# EAGLE design SuperTiny-REV2-Corrected-Stencil (EAGLE 9.6.2)
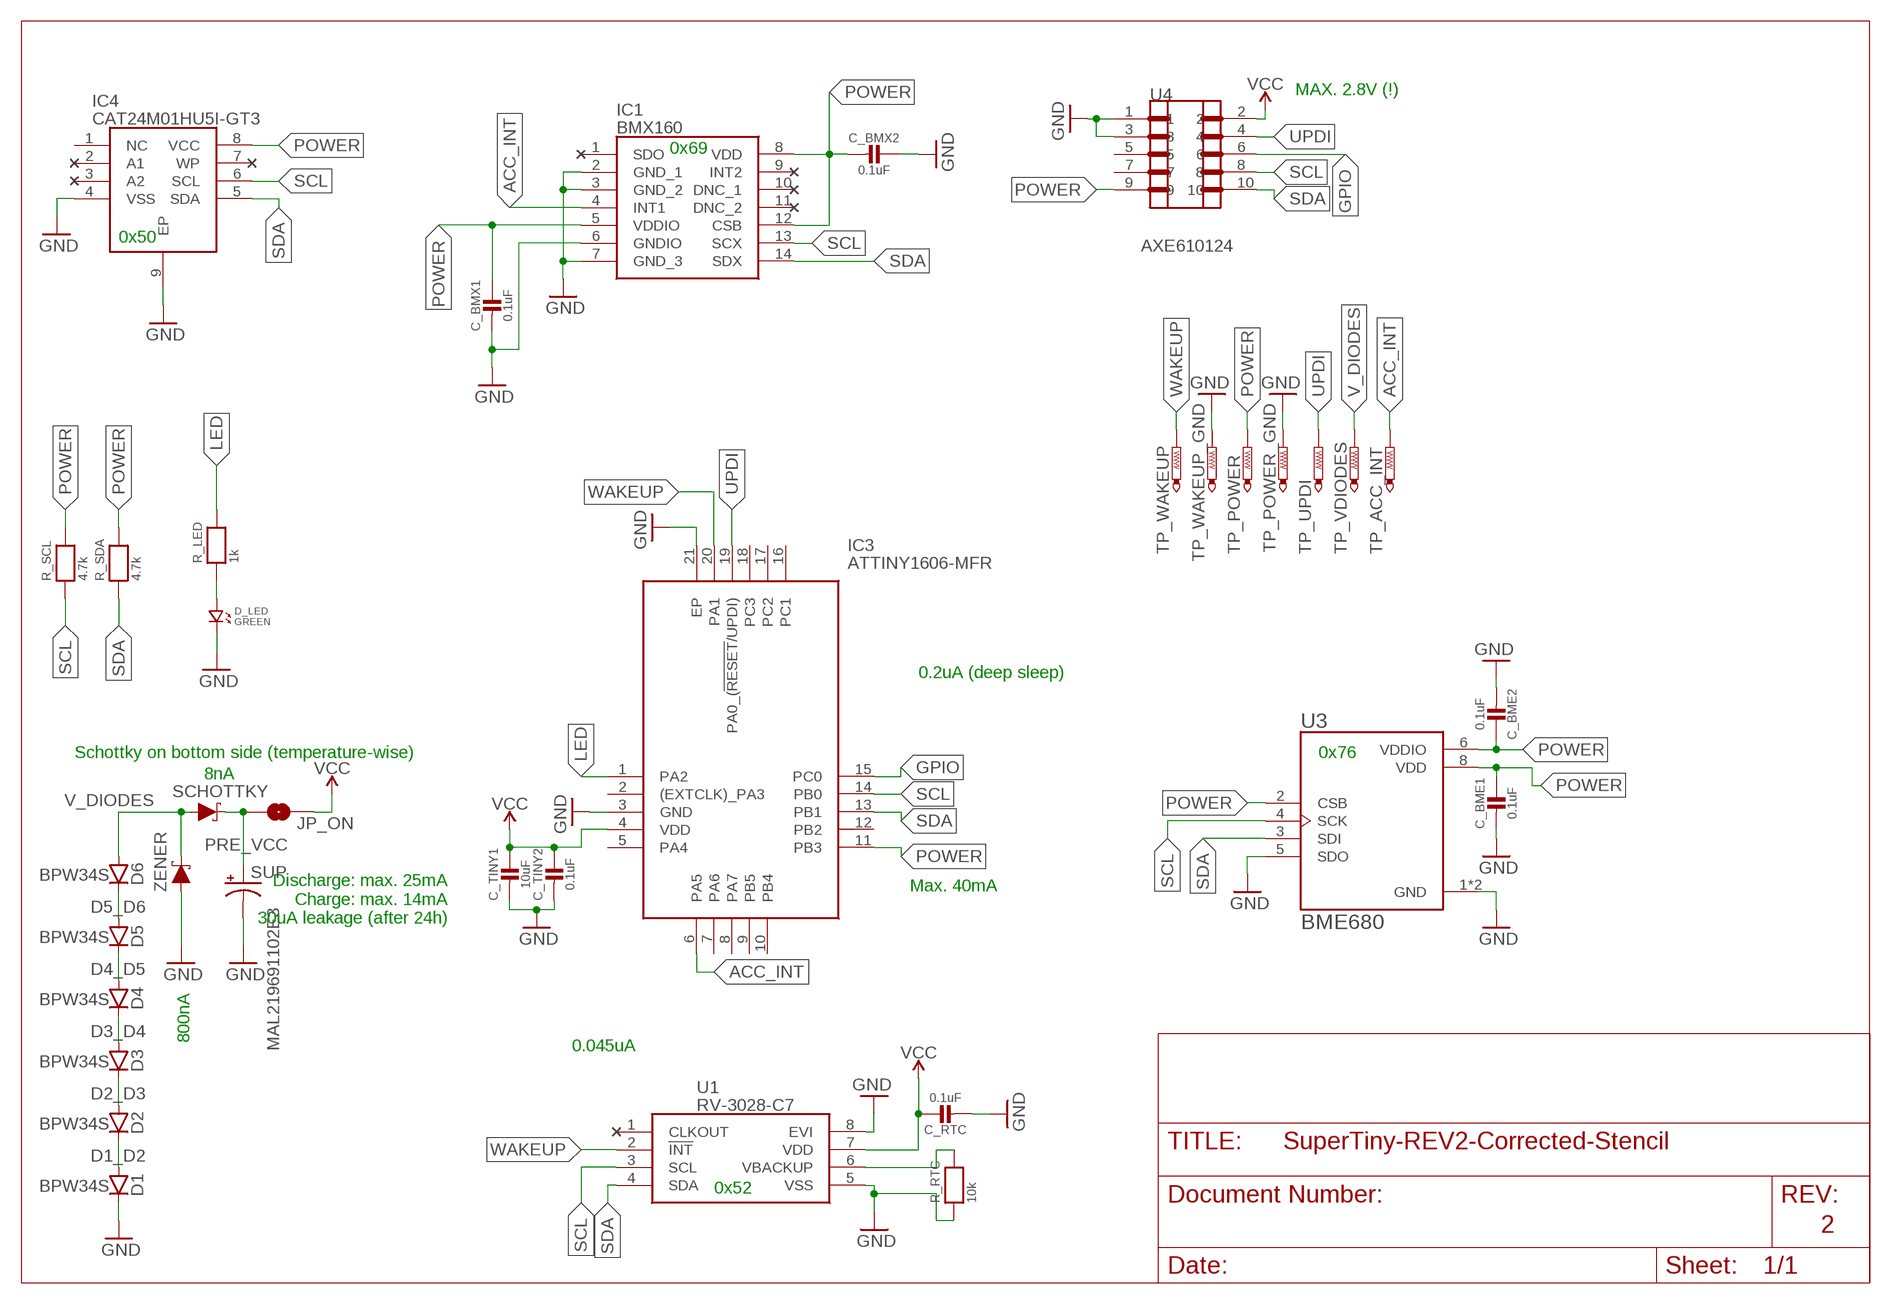
[diagram p0: schematic, sheet 1]

## Parts
C_BME1  0.1uF  MICROBUILDER_CAP_CERAMIC_0402MP  [MICROBUILDER__0402MP]
C_BME2  0.1uF  MICROBUILDER_CAP_CERAMIC_0402MP  [MICROBUILDER__0402MP]
C_BMX1  0.1uF  MICROBUILDER_CAP_CERAMIC_0402MP  [MICROBUILDER__0402MP]
C_BMX2  0.1uF  MICROBUILDER_CAP_CERAMIC_0402MP  [MICROBUILDER__0402MP]
C_RTC  0.1uF  MICROBUILDER_CAP_CERAMIC_0402MP  [MICROBUILDER__0402MP]
C_TINY1  10uF  MICROBUILDER_CAP_CERAMIC_0402MP  [MICROBUILDER__0402MP]
C_TINY2  0.1uF  MICROBUILDER_CAP_CERAMIC_0402MP  [MICROBUILDER__0402MP]
D1  BPW34S  [BPW34S]
D2  BPW34S  [BPW34S]
D3  BPW34S  [BPW34S]
D4  BPW34S  [BPW34S]
D5  BPW34S  [BPW34S]
D6  BPW34S  [BPW34S]
D_LED  GREEN  CMONR_STANDARDPARTS_LED.0402  [CMONR_STANDARDPARTS_0402.LED]
IC1  BMX160  [PQFN50P300X250X88-14N]
IC3  ATTINY1606-MFR  [QFN40P300X300X90-21N]
IC4  CAT24M01HU5I-GT3  [SON50P300X200X55-9N]
JP_ON  JUMPER-SMT_2_NO_NO-SILK  [SMT-JUMPER_2_NO_NO-SILK]
R_LED  1k  MICROBUILDER_RESISTOR_0402MP  [MICROBUILDER__0402MP]
R_RTC  10k  MICROBUILDER_RESISTOR_0402MP  [MICROBUILDER__0402MP]
R_SCL  4.7k  MICROBUILDER_RESISTOR_0402MP  [MICROBUILDER__0402MP]
R_SDA  4.7k  MICROBUILDER_RESISTOR_0402MP  [MICROBUILDER__0402MP]
SCHOTTKY  NSR0140P2T5G  [NSR0140P2T5G]
SUP  MAL219691102E3  [MAL219691102E3]
TP_ACC_INT  PTR1TP06SQ  [TP06SQ]
TP_POWER  PTR1TP06SQ  [TP06SQ]
TP_POWER_GND  PTR1TP06SQ  [TP06SQ]
TP_UPDI  PTR1TP06SQ  [TP06SQ]
TP_VDIODES  PTR1TP06SQ  [TP06SQ]
TP_WAKEUP  PTR1TP06SQ  [TP06SQ]
TP_WAKEUP_GND  PTR1TP06SQ  [TP06SQ]
U1  RV-3028-C7  [RV3028C7]
U3  BME680  [PSON80P300X300X100-8N]
U4  AXE610124  [AXE610124]
ZENER  MMSZ4683T1G  [MMSZ4683T1G]

## Nets
ACC_INT: IC1.4(INT1) IC3.6(PA5) TP_ACC_INT.TP
D1_D2: D1.PLUS D2.MINUS
D2_D3: D2.PLUS D3.MINUS
D3_D4: D3.PLUS D4.MINUS
D4_D5: D4.PLUS D5.MINUS
D5_D6: D5.PLUS D6.MINUS
GND: C_BME1.2 C_BME2.2 C_BMX1.2 C_BMX2.1 C_RTC.2 C_TINY1.2 C_TINY2.2 D1.MINUS D_LED.P$2 IC1.2(GND_1) IC1.3(GND_2) IC1.6(GNDIO) IC1.7(GND_3) IC3.3(GND) IC3.21(EP) IC4.4(VSS) IC4.9(EP) R_RTC.1 SUP.MINUS(-) TP_POWER_GND.TP TP_WAKEUP_GND.TP U1.5(VSS) U1.8(EVI) U3.1(GND) U3.5(SDO) U3.7(GND) U4.1 U4.3 ZENER.P$1(AN)
GPIO: IC3.15(PC0) U4.6
LED: IC3.1(PA2) R_LED.2
N$1: R_RTC.2 U1.6(VBACKUP)
N$9: D_LED.P$1 R_LED.1
POWER: C_BME1.1 C_BME2.1 C_BMX1.1 C_BMX2.2 IC1.5(VDDIO) IC1.8(VDD) IC1.12(CSB) IC3.11(PB3) IC4.8(VCC) R_SCL.2 R_SDA.2 TP_POWER.TP U3.2(CSB) U3.6(VDDIO) U3.8(VDD) U4.9
PRE_VCC: JP_ON.1 SCHOTTKY.P$2(CA) SUP.PLUS(+)
SCL: IC1.13(SCX) IC3.14(PB0) IC4.6(SCL) R_SCL.1 U1.3(SCL) U3.4(SCK) U4.8
SDA: IC1.14(SDX) IC3.13(PB1) IC4.5(SDA) R_SDA.1 U1.4(SDA) U3.3(SDI) U4.10
UPDI: IC3.19(PA0_(!RESET!/UPDI)) TP_UPDI.TP U4.4
V_DIODES: D6.PLUS SCHOTTKY.P$1(AN) TP_VDIODES.TP ZENER.P$2(CA)
VCC: C_RTC.1 C_TINY1.1 C_TINY2.1 IC3.4(VDD) JP_ON.2 U1.7(VDD) U4.2
WAKEUP: IC3.20(PA1) TP_WAKEUP.TP U1.2(!INT)
Unconnected: IC1.1(SDO) IC1.9(INT2) IC1.10(DNC_1) IC1.11(DNC_2) IC3.2((EXTCLK)_PA3) IC3.5(PA4) IC3.7(PA6) IC3.8(PA7) IC3.9(PB5) IC3.10(PB4) IC3.12(PB2) IC3.16(PC1) IC3.17(PC2) IC3.18(PC3) IC4.1(NC) IC4.2(A1) IC4.3(A2) IC4.7(WP) U1.1(CLKOUT) U4.5 U4.7

## Notes on the sheet
- MAX. 2.8V (!)
- 0x69
- 0x50
- 0.2uA (deep sleep)
- Schottky on bottom side (temperature-wise) | 0x76
- 8nA
- Discharge: max. 25mA
  Charge: max. 14mA
  30uA leakage (after 24h)
- Max. 40mA
- 800nA
- 0.045uA
- 0x52
- 2

## Library data of the parts
C_BME1 C_BME2 C_TINY1 C_TINY2 = TinyPICO:MICROBUILDER_CAP_CERAMIC: Ceramic Capacitors For new designs, use the packages preceded by an '_' character since they are more reliable: The following footprints should be used on most boards: _0402 - Standard footprint for regular board layouts _0603 - Standard footprint for regular board layouts _0805 - Standard footprint for regular board layouts _1206 - Standard footprint for regular board layouts For extremely tight-pitch boards where space is at a premium, the following 'micro-pitch' footprints can be used (smaller pads, no silkscreen outline, etc.): _0402MP - Micro-pitch footprint for very dense/compact boards _0603MP - Micro-pitch footprint for very dense/compact boards _0805MP - Micro-pitch footprint for very dense/compact boards _1206MP - Micro-pitch footprint for very dense/compact boards
C_BMX1 C_BMX2 C_RTC = TinyPICO:MICROBUILDER_CAP_CERAMIC: Ceramic Capacitors For new designs, use the packages preceded by an '_' character since they are more reliable: The following footprints should be used on most boards: _0402 - Standard footprint for regular board layouts _0603 - Standard footprint for regular board layouts _0805 - Standard footprint for regular board layouts _1206 - Standard footprint for regular board layouts For extremely tight-pitch boards where space is at a premium, the following 'micro-pitch' footprints can be used (smaller pads, no silkscreen outline, etc.): _0402MP - Micro-pitch footprint for very dense/compact boards _0603MP - Micro-pitch footprint for very dense/compact boards _0805MP - Micro-pitch footprint for very dense/compact boards _1206MP - Micro-pitch footprint for very dense/compact boards; SPICEPREFIX: C
D1-D6 = TimmOsramBPW34S:BPW34S
D_LED = TinyPICO:CMONR_STANDARDPARTS_LED
IC1 = BMX160_V2:BMX160: IMUs - Inertial Measurement Units 9-axis (9DOF) Absolute Orientation MEMS Sensor Source: Datasheet <http://www.mouser.com/datasheet/2/783/BST-BMX160-DS000-11-1480547.pdf>; DESCRIPTION: IMUs - Inertial Measurement Units 9-axis (9DOF) Absolute Orientation MEMS Sensor; HEIGHT: 0.88mm; MANUFACTURER_NAME: Bosch Sensortec; MANUFACTURER_PART_NUMBER: BMX160; MOUSER_PART_NUMBER: 262-BMX160; MOUSER_PRICE-STOCK: https://www.mouser.com/Search/Refine.aspx?Keyword=262-BMX160
IC3 = ATTINY1606-MFR-V2:ATTINY1606-MFR: 8-bit Microcontrollers - MCU 20MHz, 16KB, VQFN20, Ind 125C, Green, T&R Source: Datasheet <http://ww1.microchip.com/downloads/en/DeviceDoc/ATtiny806_1606_Data_Sheet_40002029A.pdf>; DESCRIPTION: 8-bit Microcontrollers - MCU 20MHz, 16KB, VQFN20, Ind 125C, Green, T&R; HEIGHT: 0.9mm; MANUFACTURER_NAME: Microchip; MANUFACTURER_PART_NUMBER: ATTINY1606-MFR; MOUSER_PART_NUMBER: 556-ATTINY1606-MFR; MOUSER_PRICE-STOCK: https://www.mouser.com/Search/Refine.aspx?Keyword=556-ATTINY1606-MFR
IC4 = CAT24M01HU5I-GT3-CorrectedV2:CAT24M01HU5I-GT3: EEPROM 1MB I2C SERIAL EEPROM Source: Datasheet <http://www.onsemi.com/pub/Collateral/CAT24M01-D.PDF>; ALLIED_NUMBER: 70300250; ALLIED_PRICE-STOCK: http://www.alliedelec.com/on-semiconductor-cat24m01hu5i-gt3/70300250/; DESCRIPTION: EEPROM 1MB I2C SERIAL EEPROM; HEIGHT: 0.55mm; MANUFACTURER_NAME: ON Semiconductor; MANUFACTURER_PART_NUMBER: CAT24M01HU5I-GT3; MOUSER_PART_NUMBER: 863-CAT24M01HU5I-GT3; MOUSER_PRICE-STOCK: https://www.mouser.com/Search/Refine.aspx?Keyword=863-CAT24M01HU5I-GT3; RS_PART_NUMBER: 7814831P; RS_PRICE-STOCK: http://uk.rs-online.com/web/p/products/7814831P
JP_ON = SparkFun-Jumpers-NoCream:JUMPER-SMT_2_NO: Normally open jumper This jumper has two pads in close proximity to each other. Apply solder to close the connection. Round pads are easier to solder for beginners, but are a lot larger. SparkFun Product that uses the round pads: SparkFun EL Sequencer <https://www.sparkfun.com/products/12781>
R_LED R_RTC R_SCL R_SDA = TinyPICO:MICROBUILDER_RESISTOR: Resistors 0402 - 0402 Surface Mount Package 22 Ohm 1% 1/16W [Digikey: 311-22.0LRTR-ND] 33 Ohm 5% 1/16W 1.0K 5% 1/16W 1.5K 5% 1/16W 2.0K 1% 1/16W 10.0K 1% 1/16W [Digikey: 311-10.0KLRTR-ND] 10.0K 5% 1/16W [Digikey: RMCF0402JT10K0TR-ND] 12.1K 1% 1/16W [Digikey: 311-22.0LRTR-ND] 100.0K 5% 1/16W 0603 - 0603 Surface Mount Package 0 Ohm 1/10 Watt 1% Resistor 15 Ohm 1/10 Watt 1% Resistor 33 Ohm 1/10 Watt 1% Resistor 49.9 Ohm 1/10 Watt 1% Resistor 100 Ohm 1/10 Watt 1% Resistor 150 Ohm 1/10 Watt 1% Resistor 240 Ohm 1/10 Watt 1% Resistor 390 Ohm 1/10 Watt 1% Resistor 560 Ohm 1/10 Watt 1% Resistor 680 Ohm 1/10 Watt 1% Resistor 750 Ohm 1/10 Watt 1% Resistor 1.0K Ohm 1/10 Watt 1% Resistor 1.5K Ohm 1/10 Watt 1% Resistor 2.0K Ohm 1/10 Watt 1% Resistor 2.2K Ohm 1/10 Watt 1% Resistor 3.3K Ohm 1/10 Watt 1% Resistor 4.7K Ohm 1/10 Watt 1% Resistor 10.0K Ohm 1/10 Watt 1% Resistor 12.0K Ohm 1/10 Watt 1% Resistor 12.1K Ohm 1/10 Watt 1% Resistor 20.0K Ohm 1/10 Watt 1% Resistor 33.0K Ohm 1/10 Watt 1% Resistor 100.0K Ohm 1/10 Watt 1% Resistor 0805 - 0805 Surface Mount Package 0 Ohm 1/8 Watt 1% Resistor 33 Ohm 1/8 Watt 1% Resistor 100 Ohm 1/8 Watt 1% Resistor 150 Ohm 1/8 Watt 1% Resistor 200 Ohm 1/8 Watt 1% Resistor 240 Ohm 1/8 Watt 1% Resistor 330 Ohm 1/8 Watt 1% Resistor 390 Ohm 1/8 Watt 1% Resistor 470 Ohm 1/8 Watt 1% Resistor 1.0K Ohm 1/8 Watt 1% Resistor 1.5K Ohm 1/8 Watt 1% Resistor 2.0K Ohm 1/8 Watt 1% Resistor 4.7K Ohm 1/8 Watt 1% Resistor 5.1K Ohm 1/8 Watt 1% Resistor 5.6K Ohm 1/8 Watt 1% Resistor 10.0K Ohm 1/8 Watt 1% Resistor 22.0K Ohm 1/8 Watt 1% Resistor 33.0K Ohm 1/8 Watt 1% Resistor 100K Ohm 1/8 Watt 1% Resistor 1206 - 1206 Surface Mount Package 2012 - 2010 Surface Mount Package 0.11 Ohm 1/2 Watt 1% Resistor - Digikey: RHM.11UCT-ND
SCHOTTKY = NSR0140P2T5G:NSR0140P2T5G
SUP = VishaySupercapsLayingV3:MAL219691102E3
TP_ACC_INT TP_POWER TP_POWER_GND TP_UPDI TP_VDIODES TP_WAKEUP TP_WAKEUP_GND = testpad:PTR1: TEST PIN
U1 = RV-3028-C7:RV-3028-C7: Extreme Low Power RTC Module Source: Datasheet <http://www.microcrystal.com/images/_Product-Documentation/02_Oscillator_&_RTC_Modules/01_Datasheet/RV-3028-C7.pdf>; DESCRIPTION: Extreme Low Power RTC Module; HEIGHT: 0mm; MANUFACTURER_NAME: Micro Crystal AG; MANUFACTURER_PART_NUMBER: RV-3028-C7; SPICEPREFIX: X
U3 = BME680:BME680: Integrated Environmental Unit; DESCRIPTION: Gas, Humidity, Pressure, Temperature Sensor I²C, SPI Output; DIGI-KEY_PART_NUMBER: 828-1077-1-ND; DIGI-KEY_PURCHASE_URL: https://www.digikey.com/product-detail/en/bosch-sensortec/BME680/828-1077-1-ND/7401321?utm_source=snapeda&utm_medium=aggregator&utm_campaign=symbol; MF: Bosch Sensortec; MP: BME680; PACKAGE: LGA-8 Bosch Tools
U4 = PanasonicA4SConnectorsV4_CreamAdjust:AXE610124
ZENER = MMSZ4683T1G:MMSZ4683T1G

## Board
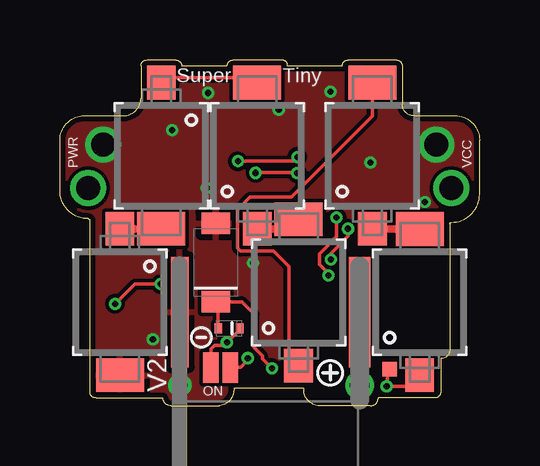
[diagram p1: board, top side]
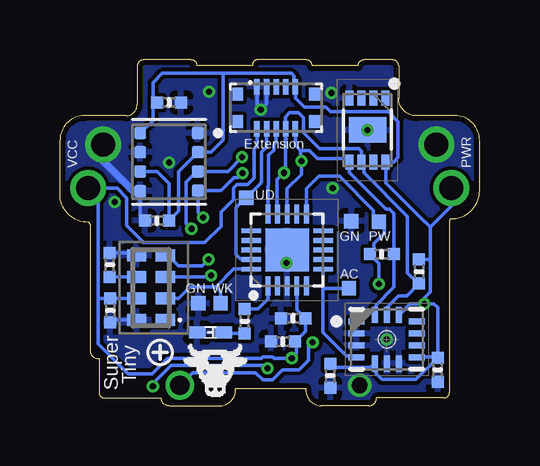
[diagram p2: board, bottom side, seen from below]

Size 17.5 x 14.43 mm. Coordinates in mm from the lower left corner, seen from the top.
Outline: 1.5,0.32 4.3,0.32 arc90 4.62,0 6.62,0 arc90 7.25,0.72 10.18,0.72 arc90 10.8,0 12.95,0 arc90 13.27,0.32 15.6,0.32 arc90 15.88,0.55 15.88,1.98 arc90 16.25,2.27 16.25,7.58 arc-90 16.32,7.65 arc90 17.5,8.83 17.5,11.08 arc90 16.48,12.1 14.75,12.1 arc-90 14.27,12.58 14.27,14.18 arc90 14.02,14.43 12.02,14.43 arc90 11.77,14.18 9.47,14.18 arc90 9.3,14.43 7.22,14.43 arc90 6.97,14.18 5.07,14.18 arc90 4.82,14.43 3.62,14.43 arc90 3.38,14.18 3.38,12.83 arc-90 2.65,12.1 1.02,12.1 arc90 0,11.08 0,8.97 arc90 1.17,7.8 arc-90 1.25,7.72 1.25,0.57 arc90 1.5,0.32
Copper layers (1*16): Top 0.035mm / dielectric 0.8mm / Bottom 0.035mm
Design rules "default *": minimum track width 6mil, minimum drill 10mil, track to track 6mil, track to pad 6mil, pad to pad 6mil, via to via 6mil, smd to smd 6mil, copper to edge 9mil, drill to drill 6mil, minimum pad ring 5mil, minimum via ring 5mil, stop-mask expansion 0mil, vias tented up to drill 12mil, thermal gap 10mil

### Footprints (pad centres in the part's own frame; a part is rotated, then mirrored left to right if it is on the bottom)
MICROBUILDER__0402MP = smd 0.5 x 0.5: 1 -0.508,0; 2 0.508,0
BPW34S = smd 1.4 x 2: MINUS 5.3,2 | smd 1.4 x 1.2: PLUS -0.8,2
CMONR_STANDARDPARTS_0402.LED = smd 0.7 x 0.5: P$1 -0.55,0; P$2 0.55,0
PQFN50P300X250X88-14N = smd 0.675 x 0.25: 1 -1.265,0.75; 2 -1.265,0.25; 3 -1.265,-0.25; 4 -1.265,-0.75; 8 1.26,-0.75; 9 1.26,-0.25; 10 1.26,0.25; 11 1.26,0.75 | smd 0.25 x 0.675: 5 -0.5,-1.015; 6 0,-1.015; 7 0.5,-1.015; 12 0.5,1.01; 13 0,1.01; 14 -0.5,1.01
QFN40P300X300X90-21N = smd 0.8 x 0.2: 1 -1.5,0.8; 2 -1.5,0.4; 3 -1.5,0; 4 -1.5,-0.4; 5 -1.5,-0.8; 11 1.5,-0.8; 12 1.5,-0.4; 13 1.5,0; 14 1.5,0.4; 15 1.5,0.8 | smd 0.2 x 0.8: 6 -0.8,-1.5; 7 -0.4,-1.5; 8 0,-1.5; 9 0.4,-1.5; 10 0.8,-1.5; 16 0.8,1.5; 17 0.4,1.5; 18 0,1.5; 19 -0.4,1.5; 20 -0.8,1.5 | smd 1.8 x 1.8: 21 0,0
SON50P300X200X55-9N = smd 0.63 x 0.32: 1 -1.33,0.75; 2 -1.33,0.25; 3 -1.33,-0.25; 4 -1.33,-0.75; 5 1.33,-0.75; 6 1.33,-0.25; 7 1.33,0.25; 8 1.33,0.75 | smd 1.06 x 1.56: 9 0,0
SMT-JUMPER_2_NO_NO-SILK = smd 0.635 x 1.27: 1 -0.406,0; 2 0.406,0
NSR0140P2T5G = smd 0.3 x 0.4: P$1 0.45,0; P$2 -0.45,0
MAL219691102E3 = smd 0.74 x 4.6: MINUS 3.58,-5.605 | smd 0.9 x 4.6: PLUS -3.92,-5.605
TP06SQ = smd 0.6 x 0.6: TP 0,0
RV3028C7 = smd 0.5 x 0.8: 1 -1.35,-0.6; 2 -0.45,-0.6; 3 0.45,-0.6; 4 1.35,-0.6; 5 1.35,0.6; 6 0.45,0.6; 7 -0.45,0.6; 8 -1.35,0.6
PSON80P300X300X100-8N = smd 0.5 x 0.5: 1 1.2,1.2; 2 1.2,0.4; 3 1.2,-0.4; 4 1.2,-1.2; 5 -1.2,-1.22; 6 -1.2,-0.4; 7 -1.2,0.4; 8 -1.2,1.2
AXE610124 = smd 0.23 x 0.65: 1 0.81,-0.88; 2 0.81,0.87; 3 0.41,-0.88; 4 0.41,0.87; 5 0.01,-0.88; 6 0.01,0.87; 7 -0.39,-0.88; 8 -0.39,0.87; 9 -0.79,-0.88; 10 -0.79,0.87 | smd 0.45 x 0.53: DNC1 -1.59,0.57; DNC2 -1.59,-0.569; DNC3 1.607,-0.569; DNC4 1.607,0.57
MMSZ4683T1G = smd 0.91 x 1.2: P$1 1.635,0; P$2 -1.635,0

### Placement (x,y rotation side)
C_BME1  12.95,12.65 0 bottom
C_BME2  13.45,7.72 180 bottom
C_BMX1  6.22,1.25 270 bottom
C_BMX2  1.75,1.5 90 bottom
C_RTC  15.4,3.98 270 bottom
C_TINY1  8.2,2.67 180 bottom
C_TINY2  7.77,3.65 180 bottom
D1  0.5,6.57 270 top
D2  2.22,12.68 270 top
D3  10.22,8.18 90 top
D4  11.95,2.48 90 top
D5  15.02,8.18 90 top
D6  17,2.07 90 top
D_LED  11.22,3.05 180 bottom
IC1  3.88,2.77 0 bottom
IC3  8.02,6.5 90 bottom
IC4  4.67,11.5 270 bottom
JP_ON  6.7,1.6 0 top
R_LED  9.8,3.52 90 bottom
R_RTC  15.43,5.88 270 bottom
R_SCL  2.52,5.6 90 bottom
R_SDA  4.08,6.32 180 bottom
SCHOTTKY  7.05,3.23 180 top
SUP  8.57,-1.7 180 top
TP_ACC_INT  5.45,4.9 0 bottom
TP_POWER  4.2,7.68 0 bottom
TP_POWER_GND  5.35,7.7 0 bottom
TP_UPDI  9.72,8.68 0 bottom
TP_VDIODES  13.75,1.52 0 top
TP_WAKEUP  10.8,4.28 0 bottom
TP_WAKEUP_GND  11.73,4.28 0 bottom
U1  13.7,4.93 90 bottom
U3  12.95,10.18 0 bottom
U4  8.47,12.43 180 bottom
ZENER  6.5,5.97 90 top

### Tracks (layer width: path | path; a pad name or v marks a point on that pad's centre or on a via)
ACC_INT
  Bottom 0.152: IC1.4 5.19,2.07 5.55,2.07 6.53,3.05 6.53,4.9 | 6.53,4.9 IC3.6 | TP_ACC_INT.TP 6.53,4.9
D1_D2
  Top 0.305: D1.PLUS D2.MINUS
D2_D3
  Top 0.152: D2.PLUS 4.42,13.68 8.02,13.68 D3.MINUS
D3_D4
  Top 0.305: D3.PLUS 9.55,7.38 D4.MINUS
D4_D5
  Top 0.152: D4.PLUS 9.55,2.07 9.55,5.8 8.9,6.45 7.53,6.45 7.4,6.58 7.4,8.17 7.93,8.7 9.65,8.7 13.02,12.08 D5.MINUS
D5_D6
  Top 0.305: D5.PLUS D6.MINUS
GND  (via drill 0.25, 0.65, 1)
  Top 0.152: SUP.MINUS
  Top 0.203: v5,0.85 SUP.MINUS
  Bottom 0.152: U1.5 14.41,6.38 R_RTC.1 | U1.8 15.29,3.57 C_RTC.2 | U4.3 8.88,12.59 9.1,12.38 | 9.1,12.38 v9.12,12.35 | U4.1 9.29,12.56 9.1,12.38 | C_BME2.2 14.15,7.92 U3.5 | 15.7,10.2 v15.7,10.9
  Bottom 0.305: U3.5 14.45,8.96 15.7,10.2
  other vias: 11.27,13.1 4.67,11.5 8.05,5.95 3.88,2.77 12.95,10.15 15.23,8.5 6.12,9.08 1.8,10.9 6.17,13.05
  pour Bottom: -0.5,14.43 -0.5,-0.08 18,-0.08 18,14.43
  pour Top: -0.5,14.43 -0.5,-0.08 18,-0.08 18,14.43
GPIO
  Bottom 0.152: IC3.15 8.82,9.17 8.79,9.2 8.79,10.45 8.58,10.67 8.58,10.89 8.48,10.99 U4.6
LED
  Bottom 0.152: IC3.1 8.82,4.45 9.24,4.03 R_LED.2
N$1
  Bottom 0.152: U1.6 14.31,5.37 R_RTC.2
N$9
  Bottom 0.152: D_LED.P$1 10.64,3.02 R_LED.1
POWER  (via drill 0.25, 1)
  Top 0.152: v2.3,4.25 3.12,5.07 v4.2,5.07
  Bottom 0.152: C_BMX2.2 2.66,1.1 4.08,1.1 4.33,1.35 4.33,1.79 IC1.5 4.38,1.77 4.54,1.61 6.07,1.61 C_BMX1.1 | IC1.12 2.9,4.25 v2.3,4.25 | R_SCL.2 2.09,6.11 2.05,6.15 | 2.05,7.45 2.26,7.67 2.29,7.67 3.9,9.29 3.9,10.15 IC4.8 3.58,10.17 3.4,10.35 3.4,11.86 3.8,12.26 6.21,12.26 6.4,12.45 7.3,12.45 7.68,12.83 U4.9 7.73,13.36 7.73,13.76 7.85,13.87 10.7,13.87 | 2.05,6.15 2.05,7.45 | 10.7,13.87 10.7,11.08 11.2,10.58 U3.2 12.55,9.78 12.55,8.12 C_BME2.1 12.94,9.27 13.45,9.78 U3.6 | 10.7,13.87 13.23,13.87 13.62,13.47 13.62,12.65 C_BME1.1 13.62,12.48 13.62,11.9 U3.8 | IC3.11 7.22,9.05 6.7,9.58 5.85,9.58 4.42,8.15 4.42,7.9 TP_POWER.TP 3.97,7.45 3.97,7.2 4.41,6.77 4.41,6.5 R_SDA.2 4.2,5.94 v4.2,5.07 | v2.3,4.25 1.9,4.25 1.75,4.1 C_BMX2.2 | v2.3,4.25 2.3,4.49 2.05,4.75 2.05,6.15 | C_BMX2.2 1.77,2.03 2.62,2.03 IC1.8 | 2.05,7.45 1.17,8.33 v1.17,9.08
PRE_VCC  (via drill 0.25, 0.8)
  Top 0.152: v12.5,0.85 | JP_ON.1 6.29,2.37 6.45,2.52 6.84,2.52 v6.96,2.64 7.5,3.18 SCHOTTKY.P$2
  Top 0.203: v12.5,0.85 SUP.PLUS
  Bottom 0.152: v6.96,2.64 7.14,2.46 7.14,1.9 7.54,1.5 8.22,1.5 8.64,1.08 9.04,1.08 9.34,1.38 11.97,1.38 v12.5,0.85
SCL  (via drill 0.25)
  Top 0.152: v11.2,5.44 11.2,5.51 10.81,5.9 10.81,6.33 11.54,7.06 v11.54,7.85 | v8.16,9.72 9.87,9.72 v9.89,9.7
  Bottom 0.152: IC1.13 3.88,4.1 3.4,4.58 3.04,4.58 R_SCL.1 2.56,5.09 3,5.54 3,7.9 4.82,9.72 4.82,10.07 IC4.6 4.92,10.62 5.03,10.72 6.67,10.72 7.34,11.4 7.34,12.03 7.55,12.23 7.92,12.23 8.1,12.05 8.1,11.57 U4.8 8.09,9.79 v8.16,9.72 8.45,9.43 8.45,8.03 IC3.14 | U1.3 11.26,5.38 v11.2,5.44 | v11.54,7.85 11.75,8.06 U3.4 10.78,8.97 10.23,9.52 10.06,9.52 v9.89,9.7
SDA  (via drill 0.25)
  Top 0.152: v11.3,6.1 11.3,6.36 12.02,7.08 v12.02,7.38 | v7.42,10.2 9.72,10.2 v9.9,10.38
  Bottom 0.152: IC1.14 4.33,3.83 4.33,4.19 3.57,4.95 R_SDA.1 3.57,8.02 3.76,8.2 3.9,8.2 5.42,9.72 IC4.5 5.57,10.32 6.77,10.32 7.1,10.65 7.46,10.65 | U1.4 13,6.28 12.55,5.82 11.57,5.82 v11.3,6.1 | v12.02,7.38 12.24,7.61 12.24,9.33 11.8,9.78 U3.3 10.5,9.78 v9.9,10.38 | IC3.13 8.02,9.05 7.42,9.65 v7.42,10.2 7.46,10.24 7.46,10.65 | U4.10 7.68,10.88 7.46,10.65
UPDI
  Bottom 0.152: IC3.19 9.55,6.12 9.97,6.12 10.15,6.3 10.15,8.27 9.75,8.68 TP_UPDI.TP 9.13,9.27 9.13,9.29 9.1,9.33 9.1,10.58 8.88,10.79 U4.4
V_DIODES  (via drill 0.25)
  Top 0.152: D6.PLUS 14.53,0.81 13.65,0.81 | 13.65,0.81 v13.62,0.81 | v8.84,1.56 8.44,1.96 8.44,2.09 8.1,2.43 8.1,3.82 7.58,4.34 ZENER.P$2 6.6,4.24 SCHOTTKY.P$1 | TP_VDIODES.TP 13.65,1.42 13.65,0.81
  Bottom 0.152: v13.62,0.81 13.62,0.93 12.88,1.68 8.96,1.68 v8.84,1.56
VCC  (via drill 0.25, 1)
  Top 0.152: JP_ON.2 7.52,1.6 7.83,1.91 v7.83,1.98
  Bottom 0.152: IC3.4 7.62,4.01 C_TINY2.1 7.27,3.1 C_TINY1.1 7.64,2.62 7.64,2.18 v7.83,1.98 8.58,1.98 8.64,2.05 9.04,2.05 9.1,1.99 13,1.99 13.66,1.32 14.65,1.32 15.9,2.58 15.9,4.43 | U1.7 C_RTC.1 15.85,4.48 15.9,4.43 | U4.2 9.29,10.82 9.41,10.7 9.41,9.5 9.69,9.22 10.11,9.22 10.25,9.07 10.25,8.6 10.78,8.07 10.78,7.47 11.46,6.8 14.01,6.8 14.72,7.51 14.72,8.68 15.12,9.08 v16.32,9.08 15.9,8.65 15.9,4.43
WAKEUP
  Bottom 0.152: U1.2 12.55,4.47 12.07,4.95 11,4.95 | 11,4.95 10.25,5.7 IC3.20 | TP_WAKEUP.TP 10.8,4.75 11,4.95

### Text on the board
tPlace: PWR | VCC | V2 | ON
bPlace: Extension | PWR | VCC | UD | PW | GN | AC | WK | GN | Tiny | Super
tNames: Super | Tiny